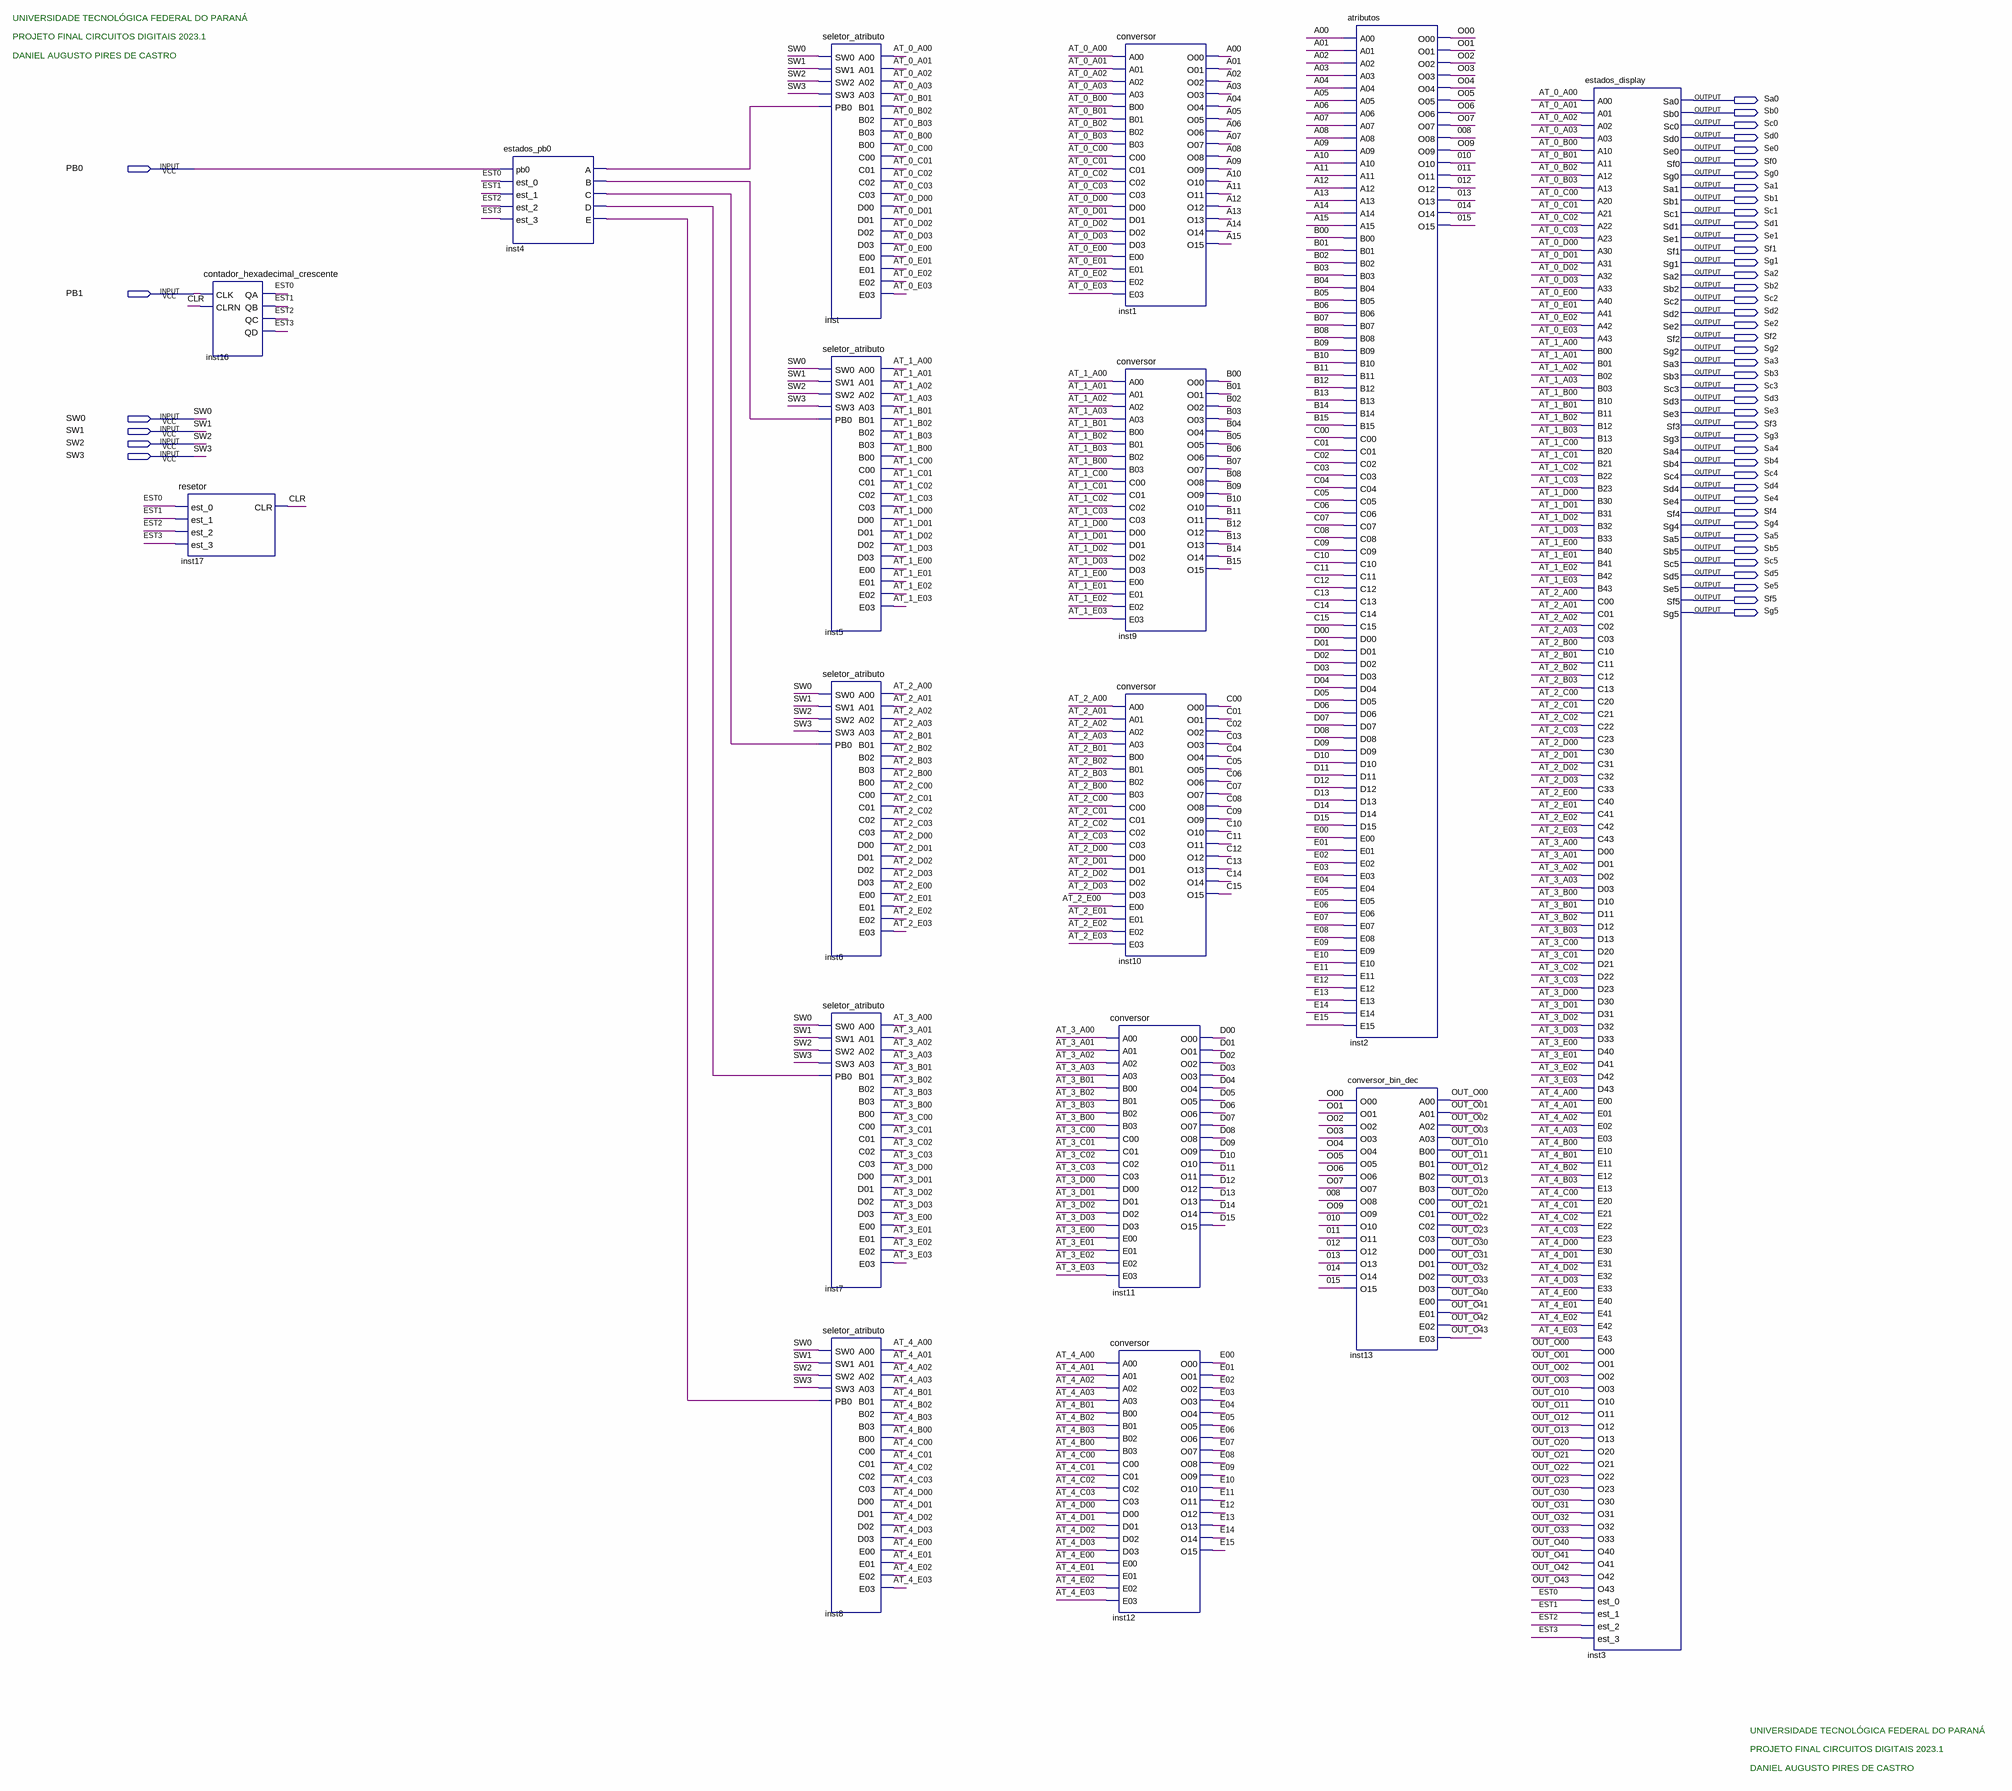
[diagram p0: schematic sheet]
// Quartus schematic projeto-final.bdf as structural Verilog: 16 symbols, 48 pins
module \projeto-final  (
  input  PB0,
  input  PB1,
  input  SW0,
  input  SW1,
  input  SW2,
  input  SW3,
  output Sa0,
  output Sb0,
  output Sc0,
  output Sd0,
  output Se0,
  output Sf0,
  output Sg0,
  output Sa1,
  output Sb1,
  output Sc1,
  output Sd1,
  output Se1,
  output Sf1,
  output Sg1,
  output Sa2,
  output Sb2,
  output Sc2,
  output Sd2,
  output Se2,
  output Sf2,
  output Sg2,
  output Sa3,
  output Sb3,
  output Sc3,
  output Sd3,
  output Se3,
  output Sf3,
  output Sg3,
  output Sa4,
  output Sb4,
  output Sc4,
  output Sd4,
  output Se4,
  output Sf4,
  output Sg4,
  output Sa5,
  output Sb5,
  output Sc5,
  output Sd5,
  output Se5,
  output Sf5,
  output Sg5
);

  wire \008 , \010 , \011 , \012 , \013 , \014 , \015 , A00, A01, A02, A03, A04, A05, A06, A07, A08, A09,
       A10, A11, A12, A13, A14, A15, AT_0_A00, AT_0_A01, AT_0_A02, AT_0_A03, AT_0_B00, AT_0_B01, AT_0_B02,
       AT_0_B03, AT_0_C00, AT_0_C01, AT_0_C02, AT_0_C03, AT_0_D00, AT_0_D01, AT_0_D02, AT_0_D03, AT_0_E00,
       AT_0_E01, AT_0_E02, AT_0_E03, AT_1_A00, AT_1_A01, AT_1_A02, AT_1_A03, AT_1_B00, AT_1_B01, AT_1_B02,
       AT_1_B03, AT_1_C00, AT_1_C01, AT_1_C02, AT_1_C03, AT_1_D00, AT_1_D01, AT_1_D02, AT_1_D03, AT_1_E00,
       AT_1_E01, AT_1_E02, AT_1_E03, AT_2_A00, AT_2_A01, AT_2_A02, AT_2_A03, AT_2_B00, AT_2_B01, AT_2_B02,
       AT_2_B03, AT_2_C00, AT_2_C01, AT_2_C02, AT_2_C03, AT_2_D00, AT_2_D01, AT_2_D02, AT_2_D03, AT_2_E00,
       AT_2_E01, AT_2_E02, AT_2_E03, AT_3_A00, AT_3_A01, AT_3_A02, AT_3_A03, AT_3_B00, AT_3_B01, AT_3_B02,
       AT_3_B03, AT_3_C00, AT_3_C01, AT_3_C02, AT_3_C03, AT_3_D00, AT_3_D01, AT_3_D02, AT_3_D03, AT_3_E00,
       AT_3_E01, AT_3_E02, AT_3_E03, AT_4_A00, AT_4_A01, AT_4_A02, AT_4_A03, AT_4_B00, AT_4_B01, AT_4_B02,
       AT_4_B03, AT_4_C00, AT_4_C01, AT_4_C02, AT_4_C03, AT_4_D00, AT_4_D01, AT_4_D02, AT_4_D03, AT_4_E00,
       AT_4_E01, AT_4_E02, AT_4_E03, B00, B01, B02, B03, B04, B05, B06, B07, B08, B09, B10, B11, B12, B13,
       B14, B15, C00, C01, C02, C03, C04, C05, C06, C07, C08, C09, C10, C11, C12, C13, C14, C15, CLR, D00,
       D01, D02, D03, D04, D05, D06, D07, D08, D09, D10, D11, D12, D13, D14, D15, E00, E01, E02, E03, E04,
       E05, E06, E07, E08, E09, E10, E11, E12, E13, E14, E15, EST0, EST1, EST2, EST3, inst4_a, inst4_b,
       inst4_c, inst4_d, inst4_e, O00, O01, O02, O03, O04, O05, O06, O07, O09, OUT_O00, OUT_O01, OUT_O02,
       OUT_O03, OUT_O10, OUT_O11, OUT_O12, OUT_O13, OUT_O20, OUT_O21, OUT_O22, OUT_O23, OUT_O30, OUT_O31,
       OUT_O32, OUT_O33, OUT_O40, OUT_O41, OUT_O42, OUT_O43;

  resetor inst17 (.est_0(EST0), .est_1(EST1), .est_2(EST2), .est_3(EST3), .CLR(CLR));
  contador_hexadecimal_crescente inst16 (.CLK(PB1), .CLRN(CLR), .QA(EST0), .QB(EST1), .QC(EST2), .QD(EST3));
  estados_pb0 inst4 (
    .pb0(PB0), .est_0(EST0), .est_1(EST1), .est_2(EST2), .est_3(EST3), .A(inst4_a), .B(inst4_b), .C(inst4_c),
    .D(inst4_d), .E(inst4_e));
  seletor_atributo inst (
    .SW0(SW0), .SW1(SW1), .SW2(SW2), .SW3(SW3), .PB0(inst4_a), .A00(AT_0_A00), .A01(AT_0_A01),
    .A02(AT_0_A02), .A03(AT_0_A03), .B01(AT_0_B01), .B02(AT_0_B02), .B03(AT_0_B03), .B00(AT_0_B00),
    .C00(AT_0_C00), .C01(AT_0_C01), .C02(AT_0_C02), .C03(AT_0_C03), .D00(AT_0_D00), .D01(AT_0_D01),
    .D02(AT_0_D02), .D03(AT_0_D03), .E00(AT_0_E00), .E01(AT_0_E01), .E02(AT_0_E02), .E03(AT_0_E03));
  seletor_atributo inst5 (
    .SW0(SW0), .SW1(SW1), .SW2(SW2), .SW3(SW3), .PB0(inst4_b), .A00(AT_1_A00), .A01(AT_1_A01),
    .A02(AT_1_A02), .A03(AT_1_A03), .B01(AT_1_B01), .B02(AT_1_B02), .B03(AT_1_B03), .B00(AT_1_B00),
    .C00(AT_1_C00), .C01(AT_1_C01), .C02(AT_1_C02), .C03(AT_1_C03), .D00(AT_1_D00), .D01(AT_1_D01),
    .D02(AT_1_D02), .D03(AT_1_D03), .E00(AT_1_E00), .E01(AT_1_E01), .E02(AT_1_E02), .E03(AT_1_E03));
  seletor_atributo inst6 (
    .SW0(SW0), .SW1(SW1), .SW2(SW2), .SW3(SW3), .PB0(inst4_c), .A00(AT_2_A00), .A01(AT_2_A01),
    .A02(AT_2_A02), .A03(AT_2_A03), .B01(AT_2_B01), .B02(AT_2_B02), .B03(AT_2_B03), .B00(AT_2_B00),
    .C00(AT_2_C00), .C01(AT_2_C01), .C02(AT_2_C02), .C03(AT_2_C03), .D00(AT_2_D00), .D01(AT_2_D01),
    .D02(AT_2_D02), .D03(AT_2_D03), .E00(AT_2_E00), .E01(AT_2_E01), .E02(AT_2_E02), .E03(AT_2_E03));
  seletor_atributo inst7 (
    .SW0(SW0), .SW1(SW1), .SW2(SW2), .SW3(SW3), .PB0(inst4_d), .A00(AT_3_A00), .A01(AT_3_A01),
    .A02(AT_3_A02), .A03(AT_3_A03), .B01(AT_3_B01), .B02(AT_3_B02), .B03(AT_3_B03), .B00(AT_3_B00),
    .C00(AT_3_C00), .C01(AT_3_C01), .C02(AT_3_C02), .C03(AT_3_C03), .D00(AT_3_D00), .D01(AT_3_D01),
    .D02(AT_3_D02), .D03(AT_3_D03), .E00(AT_3_E00), .E01(AT_3_E01), .E02(AT_3_E02), .E03(AT_3_E03));
  seletor_atributo inst8 (
    .SW0(SW0), .SW1(SW1), .SW2(SW2), .SW3(SW3), .PB0(inst4_e), .A00(AT_4_A00), .A01(AT_4_A01),
    .A02(AT_4_A02), .A03(AT_4_A03), .B01(AT_4_B01), .B02(AT_4_B02), .B03(AT_4_B03), .B00(AT_4_B00),
    .C00(AT_4_C00), .C01(AT_4_C01), .C02(AT_4_C02), .C03(AT_4_C03), .D00(AT_4_D00), .D01(AT_4_D01),
    .D02(AT_4_D02), .D03(AT_4_D03), .E00(AT_4_E00), .E01(AT_4_E01), .E02(AT_4_E02), .E03(AT_4_E03));
  conversor inst1 (
    .A00(AT_0_A00), .A01(AT_0_A01), .A02(AT_0_A02), .A03(AT_0_A03), .B00(AT_0_B00), .B01(AT_0_B01),
    .B02(AT_0_B02), .B03(AT_0_B03), .C00(AT_0_C00), .C01(AT_0_C01), .C02(AT_0_C02), .C03(AT_0_C03),
    .D00(AT_0_D00), .D01(AT_0_D01), .D02(AT_0_D02), .D03(AT_0_D03), .E00(AT_0_E00), .E01(AT_0_E01),
    .E02(AT_0_E02), .E03(AT_0_E03), .O00(A00), .O01(A01), .O02(A02), .O03(A03), .O04(A04), .O05(A05),
    .O06(A06), .O07(A07), .O08(A08), .O09(A09), .O10(A10), .O11(A11), .O12(A12), .O13(A13), .O14(A14),
    .O15(A15));
  conversor inst9 (
    .A00(AT_1_A00), .A01(AT_1_A01), .A02(AT_1_A02), .A03(AT_1_A03), .B00(AT_1_B01), .B01(AT_1_B02),
    .B02(AT_1_B03), .B03(AT_1_B00), .C00(AT_1_C00), .C01(AT_1_C01), .C02(AT_1_C02), .C03(AT_1_C03),
    .D00(AT_1_D00), .D01(AT_1_D01), .D02(AT_1_D02), .D03(AT_1_D03), .E00(AT_1_E00), .E01(AT_1_E01),
    .E02(AT_1_E02), .E03(AT_1_E03), .O00(B00), .O01(B01), .O02(B02), .O03(B03), .O04(B04), .O05(B05),
    .O06(B06), .O07(B07), .O08(B08), .O09(B09), .O10(B10), .O11(B11), .O12(B12), .O13(B13), .O14(B14),
    .O15(B15));
  conversor inst10 (
    .A00(AT_2_A00), .A01(AT_2_A01), .A02(AT_2_A02), .A03(AT_2_A03), .B00(AT_2_B01), .B01(AT_2_B02),
    .B02(AT_2_B03), .B03(AT_2_B00), .C00(AT_2_C00), .C01(AT_2_C01), .C02(AT_2_C02), .C03(AT_2_C03),
    .D00(AT_2_D00), .D01(AT_2_D01), .D02(AT_2_D02), .D03(AT_2_D03), .E00(AT_2_E00), .E01(AT_2_E01),
    .E02(AT_2_E02), .E03(AT_2_E03), .O00(C00), .O01(C01), .O02(C02), .O03(C03), .O04(C04), .O05(C05),
    .O06(C06), .O07(C07), .O08(C08), .O09(C09), .O10(C10), .O11(C11), .O12(C12), .O13(C13), .O14(C14),
    .O15(C15));
  conversor inst11 (
    .A00(AT_3_A00), .A01(AT_3_A01), .A02(AT_3_A02), .A03(AT_3_A03), .B00(AT_3_B01), .B01(AT_3_B02),
    .B02(AT_3_B03), .B03(AT_3_B00), .C00(AT_3_C00), .C01(AT_3_C01), .C02(AT_3_C02), .C03(AT_3_C03),
    .D00(AT_3_D00), .D01(AT_3_D01), .D02(AT_3_D02), .D03(AT_3_D03), .E00(AT_3_E00), .E01(AT_3_E01),
    .E02(AT_3_E02), .E03(AT_3_E03), .O00(D00), .O01(D01), .O02(D02), .O03(D03), .O04(D04), .O05(D05),
    .O06(D06), .O07(D07), .O08(D08), .O09(D09), .O10(D10), .O11(D11), .O12(D12), .O13(D13), .O14(D14),
    .O15(D15));
  conversor inst12 (
    .A00(AT_4_A00), .A01(AT_4_A01), .A02(AT_4_A02), .A03(AT_4_A03), .B00(AT_4_B01), .B01(AT_4_B02),
    .B02(AT_4_B03), .B03(AT_4_B00), .C00(AT_4_C00), .C01(AT_4_C01), .C02(AT_4_C02), .C03(AT_4_C03),
    .D00(AT_4_D00), .D01(AT_4_D01), .D02(AT_4_D02), .D03(AT_4_D03), .E00(AT_4_E00), .E01(AT_4_E01),
    .E02(AT_4_E02), .E03(AT_4_E03), .O00(E00), .O01(E01), .O02(E02), .O03(E03), .O04(E04), .O05(E05),
    .O06(E06), .O07(E07), .O08(E08), .O09(E09), .O10(E10), .O11(E11), .O12(E12), .O13(E13), .O14(E14),
    .O15(E15));
  atributos inst2 (
    .A00(A00), .A01(A01), .A02(A02), .A03(A03), .A04(A04), .A05(A05), .A06(A06), .A07(A07), .A08(A08),
    .A09(A09), .A10(A10), .A11(A11), .A12(A12), .A13(A13), .A14(A14), .A15(A15), .B00(B00), .B01(B01),
    .B02(B02), .B03(B03), .B04(B04), .B05(B05), .B06(B06), .B07(B07), .B08(B08), .B09(B09), .B10(B10),
    .B11(B11), .B12(B12), .B13(B13), .B14(B14), .B15(B15), .C00(C00), .C01(C01), .C02(C02), .C03(C03),
    .C04(C04), .C05(C05), .C06(C06), .C07(C07), .C08(C08), .C09(C09), .C10(C10), .C11(C11), .C12(C12),
    .C13(C13), .C14(C14), .C15(C15), .D00(D00), .D01(D01), .D02(D02), .D03(D03), .D04(D04), .D05(D05),
    .D06(D06), .D07(D07), .D08(D08), .D09(D09), .D10(D10), .D11(D11), .D12(D12), .D13(D13), .D14(D14),
    .D15(D15), .E00(E00), .E01(E01), .E02(E02), .E03(E03), .E04(E04), .E05(E05), .E06(E06), .E07(E07),
    .E08(E08), .E09(E09), .E10(E10), .E11(E11), .E12(E12), .E13(E13), .E14(E14), .E15(E15), .O00(O00),
    .O01(O01), .O02(O02), .O03(O03), .O04(O04), .O05(O05), .O06(O06), .O07(O07), .O08(\008 ), .O09(O09),
    .O10(\010 ), .O11(\011 ), .O12(\012 ), .O13(\013 ), .O14(\014 ), .O15(\015 ));
  conversor_bin_dec inst13 (
    .O00(O00), .O01(O01), .O02(O02), .O03(O03), .O04(O04), .O05(O05), .O06(O06), .O07(O07), .O08(\008 ),
    .O09(O09), .O10(\010 ), .O11(\011 ), .O12(\012 ), .O13(\013 ), .O14(\014 ), .O15(\015 ), .A00(OUT_O00),
    .A01(OUT_O01), .A02(OUT_O02), .A03(OUT_O03), .B00(OUT_O10), .B01(OUT_O11), .B02(OUT_O12), .B03(OUT_O13),
    .C00(OUT_O20), .C01(OUT_O21), .C02(OUT_O22), .C03(OUT_O23), .D00(OUT_O30), .D01(OUT_O31), .D02(OUT_O32),
    .D03(OUT_O33), .E00(OUT_O40), .E01(OUT_O41), .E02(OUT_O42), .E03(OUT_O43));
  estados_display inst3 (
    .A00(AT_0_A00), .A01(AT_0_A01), .A02(AT_0_A02), .A03(AT_0_A03), .A10(AT_0_B00), .A11(AT_0_B01),
    .A12(AT_0_B02), .A13(AT_0_B03), .A20(AT_0_C00), .A21(AT_0_C01), .A22(AT_0_C02), .A23(AT_0_C03),
    .A30(AT_0_D00), .A31(AT_0_D01), .A32(AT_0_D02), .A33(AT_0_D03), .A40(AT_0_E00), .A41(AT_0_E01),
    .A42(AT_0_E02), .A43(AT_0_E03), .B00(AT_1_A00), .B01(AT_1_A01), .B02(AT_1_A02), .B03(AT_1_A03),
    .B10(AT_1_B00), .B11(AT_1_B01), .B12(AT_1_B02), .B13(AT_1_B03), .B20(AT_1_C00), .B21(AT_1_C01),
    .B22(AT_1_C02), .B23(AT_1_C03), .B30(AT_1_D00), .B31(AT_1_D01), .B32(AT_1_D02), .B33(AT_1_D03),
    .B40(AT_1_E00), .B41(AT_1_E01), .B42(AT_1_E02), .B43(AT_1_E03), .C00(AT_2_A00), .C01(AT_2_A01),
    .C02(AT_2_A02), .C03(AT_2_A03), .C10(AT_2_B00), .C11(AT_2_B01), .C12(AT_2_B02), .C13(AT_2_B03),
    .C20(AT_2_C00), .C21(AT_2_C01), .C22(AT_2_C02), .C23(AT_2_C03), .C30(AT_2_D00), .C31(AT_2_D01),
    .C32(AT_2_D02), .C33(AT_2_D03), .C40(AT_2_E00), .C41(AT_2_E01), .C42(AT_2_E02), .C43(AT_2_E03),
    .D00(AT_3_A00), .D01(AT_3_A01), .D02(AT_3_A02), .D03(AT_3_A03), .D10(AT_3_B00), .D11(AT_3_B01),
    .D12(AT_3_B02), .D13(AT_3_B03), .D20(AT_3_C00), .D21(AT_3_C01), .D22(AT_3_C02), .D23(AT_3_C03),
    .D30(AT_3_D00), .D31(AT_3_D01), .D32(AT_3_D02), .D33(AT_3_D03), .D40(AT_3_E00), .D41(AT_3_E01),
    .D42(AT_3_E02), .D43(AT_3_E03), .E00(AT_4_A00), .E01(AT_4_A01), .E02(AT_4_A02), .E03(AT_4_A03),
    .E10(AT_4_B00), .E11(AT_4_B01), .E12(AT_4_B02), .E13(AT_4_B03), .E20(AT_4_C00), .E21(AT_4_C01),
    .E22(AT_4_C02), .E23(AT_4_C03), .E30(AT_4_D00), .E31(AT_4_D01), .E32(AT_4_D02), .E33(AT_4_D03),
    .E40(AT_4_E00), .E41(AT_4_E01), .E42(AT_4_E02), .E43(AT_4_E03), .O00(OUT_O00), .O01(OUT_O01),
    .O02(OUT_O02), .O03(OUT_O03), .O10(OUT_O10), .O11(OUT_O11), .O12(OUT_O12), .O13(OUT_O13), .O20(OUT_O20),
    .O21(OUT_O21), .O22(OUT_O22), .O23(OUT_O23), .O30(OUT_O30), .O31(OUT_O31), .O32(OUT_O32), .O33(OUT_O33),
    .O40(OUT_O40), .O41(OUT_O41), .O42(OUT_O42), .O43(OUT_O43), .est_0(EST0), .est_1(EST1), .est_2(EST2),
    .est_3(EST3), .Sa0(Sa0), .Sb0(Sb0), .Sc0(Sc0), .Sd0(Sd0), .Se0(Se0), .Sf0(Sf0), .Sg0(Sg0), .Sa1(Sa1),
    .Sb1(Sb1), .Sc1(Sc1), .Sd1(Sd1), .Se1(Se1), .Sf1(Sf1), .Sg1(Sg1), .Sa2(Sa2), .Sb2(Sb2), .Sc2(Sc2),
    .Sd2(Sd2), .Se2(Se2), .Sf2(Sf2), .Sg2(Sg2), .Sa3(Sa3), .Sb3(Sb3), .Sc3(Sc3), .Sd3(Sd3), .Se3(Se3),
    .Sf3(Sf3), .Sg3(Sg3), .Sa4(Sa4), .Sb4(Sb4), .Sc4(Sc4), .Sd4(Sd4), .Se4(Se4), .Sf4(Sf4), .Sg4(Sg4),
    .Sa5(Sa5), .Sb5(Sb5), .Sc5(Sc5), .Sd5(Sd5), .Se5(Se5), .Sf5(Sf5), .Sg5(Sg5));

  // Notes on the sheet:
  //   UNIVERSIDADE TECNOLÓGICA FEDERAL DO PARANÁ
  //   PROJETO FINAL CIRCUITOS DIGITAIS 2023.1
  //   DANIEL AUGUSTO PIRES DE CASTRO
  //   UNIVERSIDADE TECNOLÓGICA FEDERAL DO PARANÁ
  //   PROJETO FINAL CIRCUITOS DIGITAIS 2023.1
  //   DANIEL AUGUSTO PIRES DE CASTRO
endmodule
